# EAGLE design sht75_small (EAGLE 4.16)
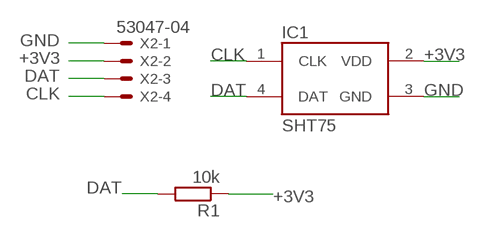
[diagram p0: schematic, sheet 1]

## Parts
IC1  SHT75  [SHT7X]
R1  10k  R-EU_R0603  [R0603]
X2  53047-04  [53047-04]

## Nets
+3V3: IC1.2(VDD) R1.1 X2.2
CLK: IC1.1(CLK) X2.4
DAT: IC1.4(DAT) R1.2 X2.3
GND: IC1.3(GND) X2.1

## Library data of the parts
IC1 = paparazzi_mm:SHT75
R1 = rcl:R-EU_: RESISTOR, European symbol
X2 = con-molex:53?-04: CONNECTOR wire to board 1.25 mm (.049 inch) pitch header

## Board
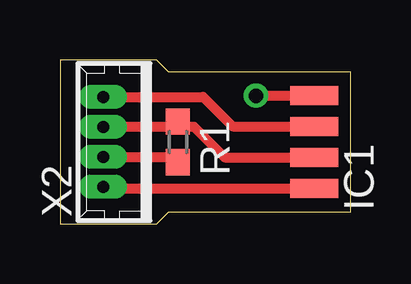
[diagram p1: board, top side]
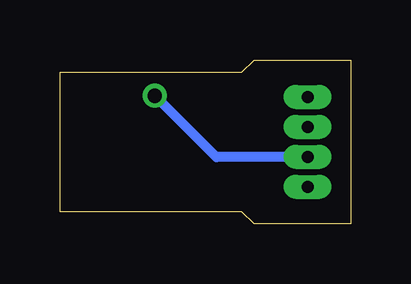
[diagram p2: board, bottom side, seen from below]

Size 12.12 x 6.85 mm. Coordinates in mm from the lower left corner, seen from the top.
Outline: 0,0 4.03,0 4.53,0.5 12.12,0.51 12.12,6.34 4.53,6.35 4.03,6.85 0,6.85 0,0
Copper layers (1*16): Top 0.035mm / dielectric 1.5mm / Bottom 0.035mm
Design rules "default": minimum track width 10mil, minimum drill 24mil, track to track 8mil, track to pad 8mil, pad to pad 8mil, via to via 8mil, smd to smd 8mil, copper to edge 40mil, drill to drill 8mil, minimum pad ring 10mil, minimum via ring 8mil, stop-mask expansion 4mil, vias tented up to drill 0mil, thermal gap 10mil

### Footprints (pad centres in the part's own frame; a part is rotated, then mirrored left to right if it is on the bottom)
SHT7X = smd 0.8 x 2: 1 -1.935,0.04; 2 -0.645,0.04; 3 0.645,0.04; 4 1.935,0.04
R0603 = smd 1.1 x 1: 1 -0.85,0; 2 0.85,0
53047-04 = drill 0.5 pad 0.698 long: 1 1.875,0.45; 2 0.625,0.45; 3 -0.625,0.45; 4 -1.875,0.45

### Placement (x,y rotation side)
IC1  10.63,3.42 90 top
R1  4.92,3.42 270 top
X2  2.25,3.42 90 top

### Tracks (layer width: path | path; a pad name or v marks a point on that pad's centre or on a via)
+3V3
  Top 0.406: IC1.2 6.85,2.78 5.58,4.06 5.03,4.06 R1.1 4.79,4.15 4.79,4.06 1.89,4.06 | 1.89,4.06 1.88,4.05 | X2.2 1.89,4.06
CLK
  Top 0.406: IC1.1 1.9,1.49 1.82,1.52 X2.4
DAT  (via drill 0.6)
  Top 0.406: R1.2 4.92,2.79 X2.3 | IC1.4 v8.17,5.35
  Bottom 0.406: 1.79,2.79 1.76,2.79 | X2.3 1.79,2.79 | v8.17,5.35 5.6,2.79 1.79,2.79
GND
  Top 0.406: X2.1 5.96,5.3 7.19,4.07 IC1.3